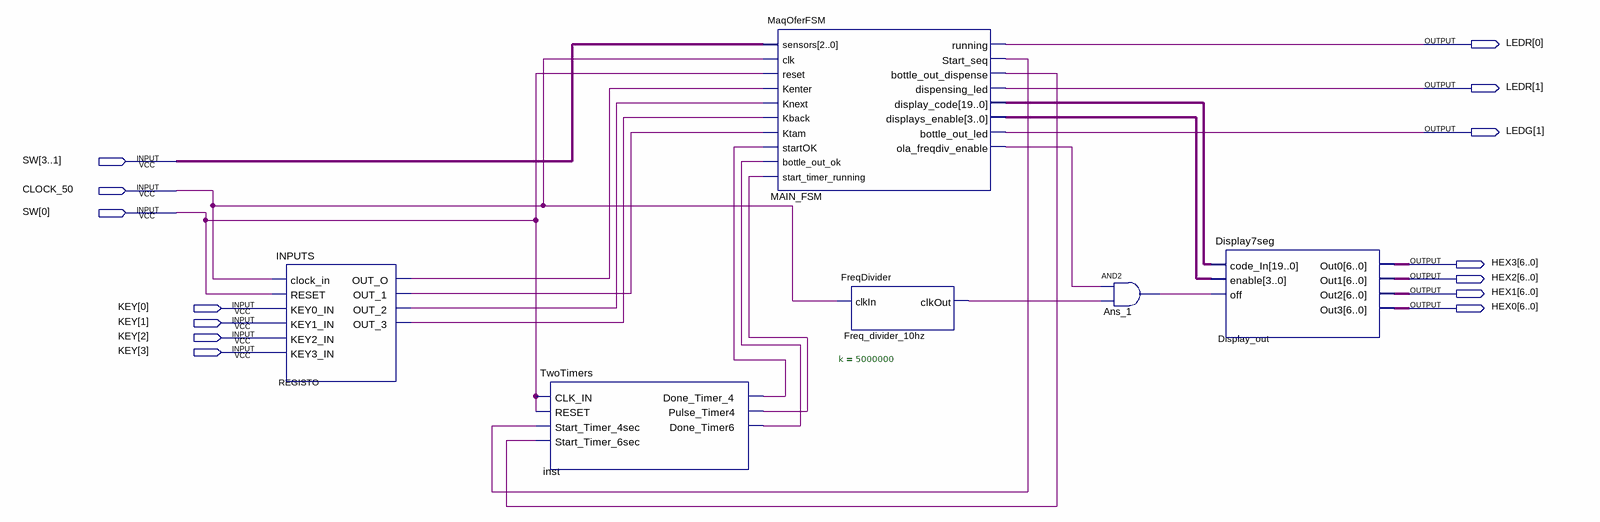
[diagram p0: schematic sheet]
// Quartus schematic MAQTOP.bdf as structural Verilog: 6 symbols, 14 pins
module MAQTOP (
  input  [3:0] SW,
  input  CLOCK_50,
  input  [3:0] KEY,
  output [1:0] LEDR,
  output [1:1] LEDG,
  output [6:0] HEX3,
  output [6:0] HEX2,
  output [6:0] HEX1,
  output [6:0] HEX0
);

  wire Ans_1_out, Freq_divider_10hz_clkout, inst_done_timer6, inst_done_timer_4, inst_pulse_timer4,
       MAIN_FSM_bottle_out_dispense, MAIN_FSM_ola_freqdiv_enable, MAIN_FSM_start_seq, REGISTO_out_1,
       REGISTO_out_2, REGISTO_out_3, REGISTO_out_o;
  wire [3:0] MAIN_FSM_displays_enable;
  wire [19:0] MAIN_FSM_display_code;

  INPUTS REGISTO (
    .clock_in(CLOCK_50), .RESET(SW[0]), .KEY0_IN(KEY[0]), .KEY1_IN(KEY[1]), .KEY2_IN(KEY[2]),
    .KEY3_IN(KEY[3]), .OUT_O(REGISTO_out_o), .OUT_1(REGISTO_out_1), .OUT_2(REGISTO_out_2),
    .OUT_3(REGISTO_out_3));
  TwoTimers inst (
    .CLK_IN(SW[0]), .RESET(SW[0]), .Start_Timer_4sec(MAIN_FSM_start_seq),
    .Start_Timer_6sec(MAIN_FSM_bottle_out_dispense), .Done_Timer_4(inst_done_timer_4),
    .Pulse_Timer4(inst_pulse_timer4), .Done_Timer6(inst_done_timer6));
  MaqOferFSM MAIN_FSM (
    .clk(CLOCK_50), .reset(SW[0]), .Kenter(REGISTO_out_o), .Knext(REGISTO_out_2), .Kback(REGISTO_out_3),
    .Ktam(REGISTO_out_1), .startOK(inst_done_timer_4), .bottle_out_ok(inst_done_timer6), .sensors(SW[3:1]),
    .start_timer_running(inst_pulse_timer4), .ola_freqdiv_enable(MAIN_FSM_ola_freqdiv_enable),
    .running(LEDR[0]), .Start_seq(MAIN_FSM_start_seq), .bottle_out_dispense(MAIN_FSM_bottle_out_dispense),
    .dispensing_led(LEDR[1]), .bottle_out_led(LEDG[1]), .display_code(MAIN_FSM_display_code),
    .displays_enable(MAIN_FSM_displays_enable));
  FreqDivider #(.k(5000000)) Freq_divider_10hz (.clkIn(CLOCK_50), .clkOut(Freq_divider_10hz_clkout));
  and Ans_1 (Ans_1_out, MAIN_FSM_ola_freqdiv_enable, Freq_divider_10hz_clkout);
  Display7seg Display_out (
    .code_In(MAIN_FSM_display_code), .enable(MAIN_FSM_displays_enable), .off(Ans_1_out), .Out0(HEX3),
    .Out1(HEX2), .Out2(HEX1), .Out3(HEX0));
endmodule
